# Altium project xdip_matching_balun.PrjPcb
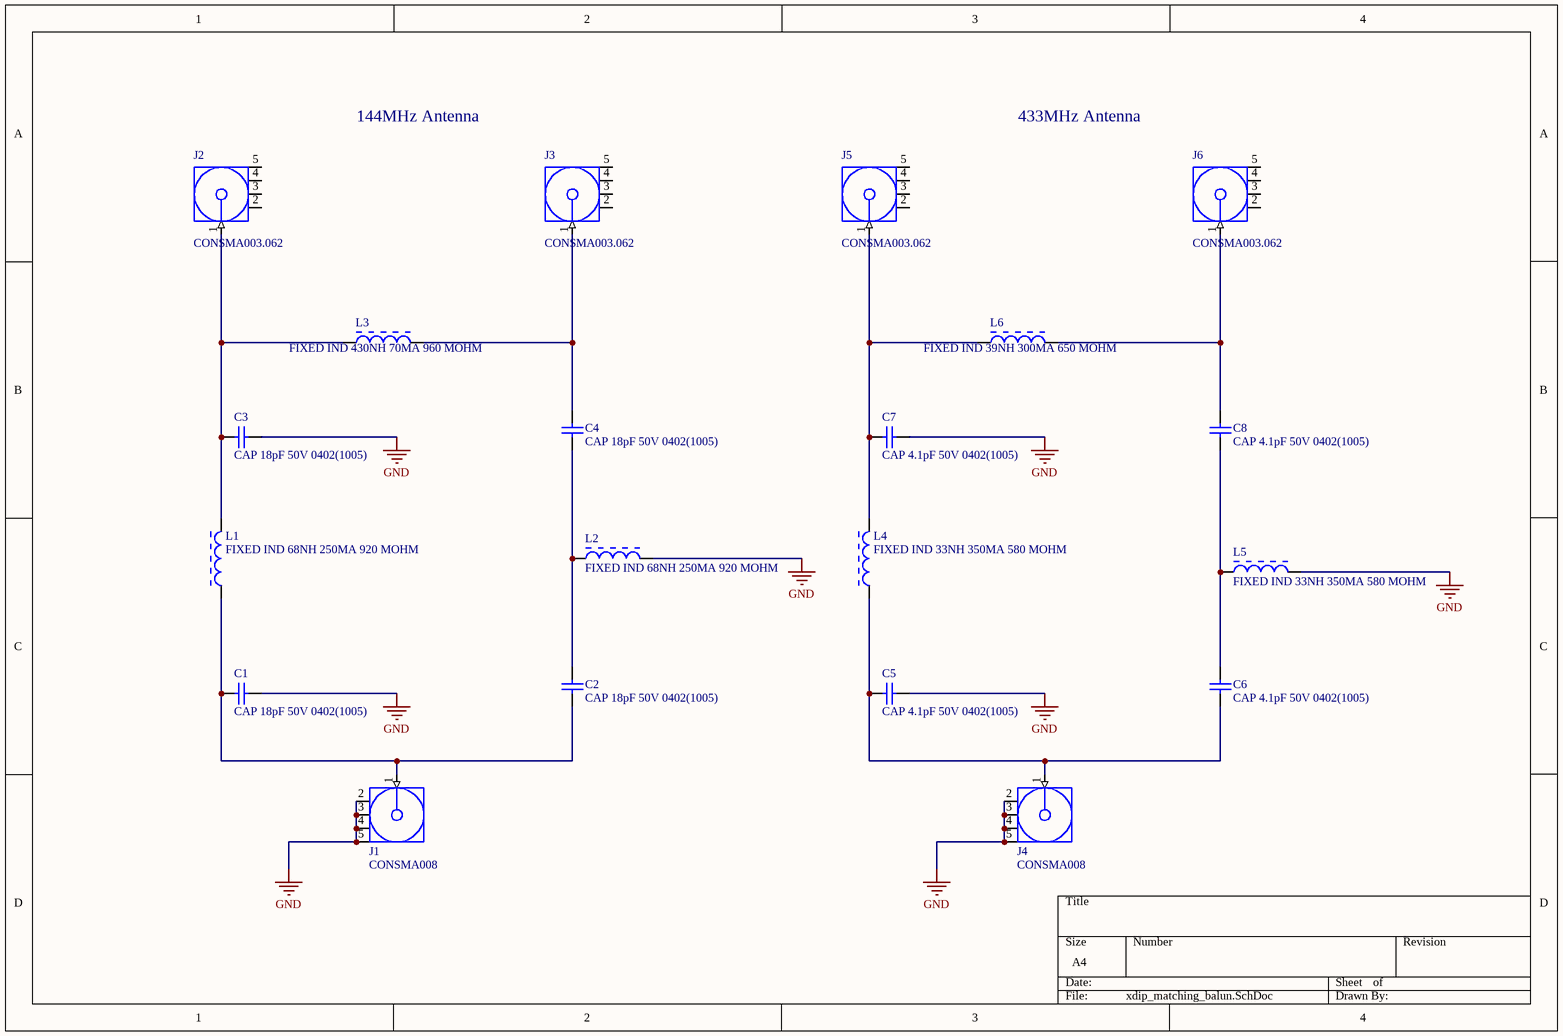
[diagram p0: xdip_matching_balun.SchDoc]
1 sheet, 20 parts. Net scope: global (net labels, ports and power ports of the same name join across sheets).
Board file: xdip_matching_balun.PcbDoc

## Sheet xdip_matching_balun.SchDoc
size A4

### Parts
C1  CAP 18pF 50V 0402(1005)  [CAPC0402(1005)60_M]
C2  CAP 18pF 50V 0402(1005)  [CAPC0402(1005)60_M]
C3  CAP 18pF 50V 0402(1005)  [CAPC0402(1005)60_M]
C4  CAP 18pF 50V 0402(1005)  [CAPC0402(1005)60_M]
C5  CAP 4.1pF 50V 0402(1005)  [CAPC0402(1005)60_M]
C6  CAP 4.1pF 50V 0402(1005)  [CAPC0402(1005)60_M]
C7  CAP 4.1pF 50V 0402(1005)  [CAPC0402(1005)60_M]
C8  CAP 4.1pF 50V 0402(1005)  [CAPC0402(1005)60_M]
J1  CONSMA008  [CON-SMA-L]
J2  CONSMA003.062  [CON-SMA-EDGE062]
J3  CONSMA003.062  [CON-SMA-EDGE062]
J4  CONSMA008  [CON-SMA-L]
J5  CONSMA003.062  [CON-SMA-EDGE062]
J6  CONSMA003.062  [CON-SMA-EDGE062]
L1  FIXED IND 68NH 250MA 920 MOHM  [MURA-IND0402_V]
L2  FIXED IND 68NH 250MA 920 MOHM  [MURA-IND0402_V]
L3  FIXED IND 430NH 70MA 960 MOHM  [MURA-IND0402_V]
L4  FIXED IND 33NH 350MA 580 MOHM  [MURA-IND0402_V]
L5  FIXED IND 33NH 350MA 580 MOHM  [MURA-IND0402_V]
L6  FIXED IND 39NH 300MA 650 MOHM  [MURA-IND0402_V]

### Nets
GND: C1.2 C3.2 C5.2 C7.2 J1.2(GND) J1.3(GND) J1.4(GND) J1.5(GND) J4.2(GND) J4.3(GND) J4.4(GND) J4.5(GND) L2.2 L5.2
NetC1_1: C1.1 C2.1 J1.1(Signal) L1.1
NetC2_2: C2.2 C4.1 L2.1
NetC3_1: C3.1 J2.1(Signal) L1.2 L3.1
NetC4_2: C4.2 J3.1(Signal) L3.2
NetC5_1: C5.1 C6.1 J4.1(Signal) L4.1
NetC6_2: C6.2 C8.1 L5.1
NetC7_1: C7.1 J5.1(Signal) L4.2 L6.1
NetC8_2: C8.2 J6.1(Signal) L6.2

Not connected (* = marked no-connect by the designer): J2 2(GND) 3(GND) 4(GND) 5(GND); J3 2(GND) 3(GND) 4(GND) 5(GND); J5 2(GND) 3(GND) 4(GND) 5(GND); J6 2(GND) 3(GND) 4(GND) 5(GND)

### Notes on the sheet
- 144MHz Antenna
- 433MHz Antenna

### Library data of the parts
C1-C4 = CMP-1034-00862-1: CAP 18pF 50V ±1% 0402 (1005 Metric) Thickness 0.6mm SMD; Case-Metric: 1005; Tolerance: Â±1%; Case-EIA: 0402; Max Thickness: 0.6 mm; Technology: SMT; Value: 18pF; Rated Voltage: 50 V
C5-C8 = CMP-1034-00324-1: CAP 4.1pF 50V ±0.1pF 0402 (1005 Metric) Thickness 0.6mm SMD; Case-EIA: 0402; Tolerance: Â±0.1pF; Case-Metric: 1005; Rated Voltage: 50 V; Max Thickness: 0.6 mm; Value: 4.1pF; Technology: SMT
J1 J4 = CMP-0168-00003-1: SMA Female PCB Mount Connector - Extended; PackageDescription: SMA Female PCB Mount Connector, Extended, Thru-Hole, 7 x 7 mm Body; PackageReference: CON-SMA-L; DatasheetVersion: revB, Feb-2010; PackageVersion: revB, Feb-2010
J2 J3 J5 J6 = CMP-0168-00029-1: SMA Female Edge Mount Connector for 0.062" Thick Board; PCB_Layout: Pads complies with manufacturer's recommendation.; PackageReference: CON-SMA-EDGE062; PackageDescription: SMA Female Edge Mount Connector for 0.062" Thick Board, 7.9 mm Body Dia.; PackageVersion: rev1.0, Aug-2006; DatasheetVersion: rev1.0, Aug-2006
L1-L5 = CMP-0499-00001-3: Chip Inductor (Chip Coil) for High Frequency Multilayer, 2 +/- 0.3 nH, 300 mA, 0402 (1005), 180mm Paper Tape; Manufacturer: Murata; PartNumber: LQG15HS2N0S02D; Self Resonance Frequency (min.): 6000 MHz; Inductance Test Frequency: 100 MHz; Inductance: 2.0 nH +/- 0.3 nH; Rated Current (Itemp) (Based on Temperature rise): 300 mA; Max. Of DC Resistance: 0.1 ohm; Q (min.): 8; Operating Temperature Range: -55 to 125 degC; Mounting Technology: Surface Mount; PackageDescription: 2-Pin SMT Inductor, 1 x 0.5 mm Body; ComponentLink2URL: http://search.murata.co.jp/Ceramy/image/img/PDF/ENG/L0075S0083LQG15HS.pdf; ComponentLink1Description: Manufacturer URL; ComponentLink3URL: http://search.murata.co.jp/Ceramy/image/img/PDF/ENG/L0075S0083LQG15HS.pdf; ComponentLink1URL: http://www.murata.com/; ComponentLink2Description: Datasheet; RoHS: Yes; ComponentLink3Description: Package Specification; Q Test Frequency: 100 MHz; PackageReference: IND0402
L6 = CMP-0499-00001-3: Chip Inductor (Chip Coil) for High Frequency Multilayer, 2 +/- 0.3 nH, 300 mA, 0402 (1005), 180mm Paper Tape; Manufacturer: Murata; PartNumber: LQG15HS2N0S02D; Self Resonance Frequency (min.): 6000 MHz; Inductance Test Frequency: 100 MHz; Inductance: 2.0 nH +/- 0.3 nH; Max. Of DC Resistance: 0.1 ohm; Q (min.): 8; Operating Temperature Range: -55 to 125 degC; Mounting Technology: Surface Mount; PackageDescription: 2-Pin SMT Inductor, 1 x 0.5 mm Body; ComponentLink2URL: http://search.murata.co.jp/Ceramy/image/img/PDF/ENG/L0075S0083LQG15HS.pdf; ComponentLink1Description: Manufacturer URL; ComponentLink3URL: http://search.murata.co.jp/Ceramy/image/img/PDF/ENG/L0075S0083LQG15HS.pdf; Rated Current (Itemp) (Based on Temperature rise): 300 mA; ComponentLink1URL: http://www.murata.com/; ComponentLink2Description: Datasheet; RoHS: Yes; ComponentLink3Description: Package Specification; Q Test Frequency: 100 MHz; PackageReference: IND0402